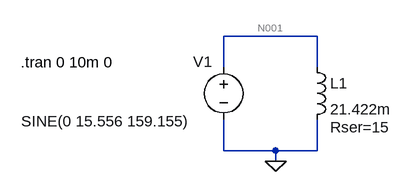
[diagram p0: schematic 1_4.asc]
1_4.asc, the LTspice schematic file:
Version 4.1
SHEET 1 880 680
WIRE 320 32 176 32
WIRE 176 80 176 32
WIRE 320 80 320 32
WIRE 176 208 176 160
WIRE 256 208 176 208
WIRE 320 208 320 160
WIRE 320 208 256 208
WIRE 256 224 256 208
FLAG 256 224 0
SYMBOL voltage 176 64 R0
WINDOW 123 0 0 Left 0
WINDOW 39 24 124 Left 2
WINDOW 0 -47 7 Left 2
WINDOW 3 -311 99 Left 2
SYMATTR InstName V1
SYMATTR Value SINE(0 15.556 159.155)
SYMBOL ind 304 64 R0
WINDOW 39 36 108 Left 2
SYMATTR SpiceLine Rser=15
SYMATTR InstName L1
SYMATTR Value 21.422m
TEXT -136 72 Left 2 !.tran 0 10m 0

The netlist it stands for:
* 1_4.asc
V1 N001 0 SINE(0 15.556 159.155)
L1 N001 0 21.422m Rser=15
.tran 0 10m 0
.backanno
.end

* Results of the author's LTspice run, read from the files saved beside the schematic
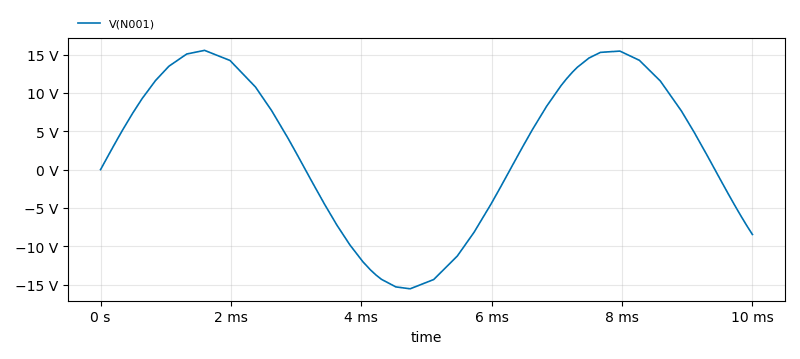
[diagram p1: Transient Analysis of 1_4.asc, plotted from the saved traces]
* Transient Analysis, 1 run:
*   V(N001): min -15.55 V, max 15.55 V, average 2.84 V, rms 10.71 V, last -8.463 V